# EAGLE design router1.3 (EAGLE 9.1.1)
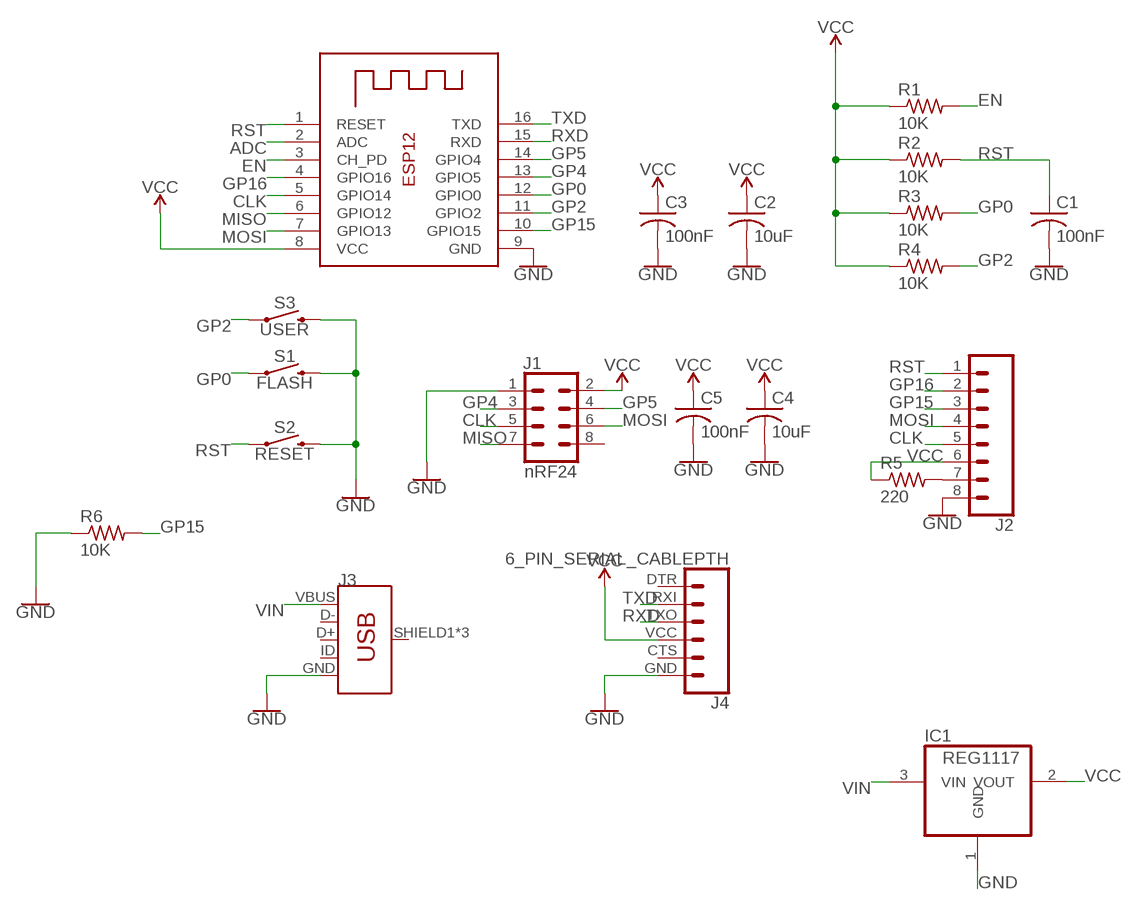
[diagram p0: schematic, sheet 1]

## Parts
C1  100nF  C-USC1206  [C1206]
C2  10uF  C-USC1206  [C1206]
C3  100nF  C-USC1206  [C1206]
C4  10uF  C-USC1206  [C1206]
C5  100nF  C-USC1206  [C1206]
IC1  REG1117  [SOT223]
J1  nRF24  CONN_04X2  [2X4]
J2  CONN_08"  [1X08]
J3  USB_MICRO-B_FEMALE-SMT  [USB-B-MICRO-SMD]
J4  6_PIN_SERIAL_CABLEPTH  [FTDI_BASIC]
R1  10K  R-US_M1206  [M1206]
R2  10K  R-US_M1206  [M1206]
R3  10K  R-US_M1206  [M1206]
R4  10K  R-US_M1206  [M1206]
R5  220  R-US_M1206  [M1206]
R6  10K  R-US_M1206  [M1206]
S1  FLASH  MOMENTARY-SWITCH-SPST-PTH-6.0MM  [TACTILE_SWITCH_PTH_6.0MM]
S2  RESET  MOMENTARY-SWITCH-SPST-PTH-6.0MM  [TACTILE_SWITCH_PTH_6.0MM]
S3  USER  MOMENTARY-SWITCH-SPST-PTH-6.0MM  [TACTILE_SWITCH_PTH_6.0MM]
X1  ESP-12  [ESP-12]

## Nets
ADC: X1.2(ADC)
CLK: J1.5 J2.5 X1.5(GPIO14)
EN: R1.2 X1.3(CH_PD)
GND: C1.2 C2.2 C3.2 C4.2 C5.2 IC1.1(GND) J1.1 J2.8 J3.GND J4.GND R6.1 S1.3 S2.3 S3.3 X1.9(GND)
GP0: R3.2 S1.1 X1.12(GPIO0)
GP2: R4.2 S3.1 X1.11(GPIO2)
GP4: J1.3 X1.13(GPIO5)
GP5: J1.4 X1.14(GPIO4)
GP15: J2.3 R6.2 X1.10(GPIO15)
GP16: J2.2 X1.4(GPIO16)
MISO: J1.7 X1.6(GPIO12)
MOSI: J1.6 J2.4 X1.7(GPIO13)
N$14: J2.7 R5.2
RST: C1.1 J2.1 R2.2 S2.1 X1.1(RESET)
RXD: J4.TXO X1.15(RXD)
TXD: J4.RXI X1.16(TXD)
VCC: C2.1 C3.1 C4.1 C5.1 IC1.2(VOUT) J1.2 J2.6 J4.VCC R1.1 R2.1 R3.1 R4.1 R5.1 X1.8(VCC)
VIN: IC1.3(VIN) J3.VBUS
Unconnected: J1.8 J3.D+ J3.D- J3.ID J3.SHIELD1(SHIELD) J3.SHIELD2(SHIELD) J3.SHIELD3(SHIELD) J4.CTS J4.DTR

## Library data of the parts
C1-C5 = adafruit:C-US: CAPACITOR, American symbol
IC1 = burr-brown:REG1117: 800mA and 1A Low Dropout (LDO) Positive Regulator 1.8V, 2.5V, 2.85V, 3.3V, 5V, and Adj; MPN: REG1117; OC_FARNELL: 1097566; OC_NEWARK: 14P6981
J1 = SparkFun-Connectors:CONN_04X2: Multi connection point. Often used as Generic Header-pin footprint for 0.1 inch spaced/style header connections On any of the 0.1 inch spaced packages, you can populate with these: Break Away Headers - Straight <https://www.sparkfun.com/products/116> (PRT-00116) Break Away Male Headers - Right Angle <https://www.sparkfun.com/products/553> (PRT-00553) Female Headers <https://www.sparkfun.com/products/115> (PRT-00115) Break Away Headers - Machine Pin <https://www.sparkfun.com/products/117> (PRT-00117) Break Away Female Headers - Swiss Machine Pin <https://www.sparkfun.com/products/743> (PRT-00743)
J2 = SparkFun-Connectors:CONN_08: Multi connection point. Often used as Generic Header-pin footprint for 0.1 inch spaced/style header connections On any of the 0.1 inch spaced packages, you can populate with these: Break Away Headers - Straight <https://www.sparkfun.com/products/116> (PRT-00116) Break Away Male Headers - Right Angle <https://www.sparkfun.com/products/553> (PRT-00553) Female Headers <https://www.sparkfun.com/products/115> (PRT-00115) Break Away Headers - Machine Pin <https://www.sparkfun.com/products/117> (PRT-00117) Break Away Female Headers - Swiss Machine Pin <https://www.sparkfun.com/products/743> (PRT-00743) Arduino Stackable Header - 8 Pin <https://www.sparkfun.com/products/9279> (PRT-09279) For SCREWTERMINALS and SPRING TERMINALS visit here: Screw Terimnals on SparkFun.com <https://www.sparkfun.com/search/results?term=Screw+Terminals> (5mm/3.5mm/2.54mm spacing) This device is also useful as a general connection point to wire up your design to another part of your project. Our various solder wires solder well into these plated through hole pads. Hook-Up Wire - Assortment (Stranded, 22 AWG) <https://www.sparkfun.com/products/11375> (PRT-11375) Hook-Up Wire - Assortment (Solid Core, 22 AWG) <https://www.sparkfun.com/products/11367> (PRT-11367) View the entire wire category on our website here <https://www.sparkfun.com/categories/141> Special notes: Molex polarized connector foot print use with SKU : PRT-08231 with associated crimp pins and housings. 1MM SMD Version SKU: PRT-10208 NOTES ON THE VARIANTS LOCK and LOCK_LONGPADS... This footprint was designed to help hold the alignment of a through-hole component (i.e. 6-pin header) while soldering it into place. You may notice that each hole has been shifted either up or down by 0.005 of an inch from it's more standard position (which is a perfectly straight line). This slight alteration caused the pins (the squares in the middle) to touch the edges of the holes. Because they are alternating, it causes a "brace" to hold the component in place. 0.005 has proven to be the perfect amount of "off-center" position when using our standard breakaway headers. Although looks a little odd when you look at the bare footprint, once you have a header in there, the alteration is very hard to notice. Also,if you push a header all the way into place, it is covered up entirely on the bottom side.; PROD_ID: CONN-08438
J3 = SparkFun-Connectors:USB_MICRO-B: USB Type Micro-B Connector Male/female and PTH/SMT variants SparkFun Products: SparkFun microB USB Breakout <https://www.sparkfun.com/products/12035> SparkFun USB microB Plug Breakout <https://www.sparkfun.com/products/10031> SparkFun ESP8266 Thing <https://www.sparkfun.com/products/13231>; PROD_ID: CONN-11752
J4 = SparkFun-Connectors:6_PIN_SERIAL_CABLE: 6-pin header connection for use with the "FTDI BASIC" pinout - CABLE SIDE. Also known as "Arduino Serial Program Header". This is used on a design to provide a 6-pin connection point for serial communication usually from a USB cable (D+/D-) to these headers (RX/TX). It also has the remaining pins necessary for programming in the Arduino evironment (DTR, GND, and sometimes VCC). Note, this device has "CABLE" in the name. It is intended to be used on a design that usually lives on the end of your USB cable and prvides the converter chip (FTDI232 or FTDI231x) to commnicate serial RX/TX. The "sister" device, named "TARGET" is inteneded to be used on a design that contains a target micro-controller that you wish to program. You can populate with some of these: Female Headers <https://www.sparkfun.com/products/115> (PRT-00115) For reference (or to suit your programming needs) check out these designs: SparkFun FTDI Basic Breakout - 5V <https://www.sparkfun.com/products/9716> (DEV-09716) SparkFun FTDI Basic Breakout - 3.3V <https://www.sparkfun.com/products/9873> (DEV-09873) SparkFun FTDI SmartBasic <https://www.sparkfun.com/products/12935> (DEV-12935) SparkFun Beefy 3 - FTDI Basic Breakout <https://www.sparkfun.com/products/13746> (DEV-13746)
R1-R6 = resistor:R-US_: RESISTOR, American symbol
S1-S3 = SparkFun-Switches:MOMENTARY-SWITCH-SPST: Momentary Switch (Pushbutton) - SPST Normally-open (NO) SPST momentary switches (buttons, pushbuttons). Variants PTH-12MM - 12mm square, through-hole Momentary Pushbutton Switch - 12mm Square <https://www.sparkfun.com/products/9190> (COM-09190) PTH-6.0MM, PTH-6.0MM-KIT - 6.0mm square, through-hole Mini Pushbutton Switch <https://www.sparkfun.com/products/97> (COM-00097) KIT package intended for soldering kit's - only one side of pads' copper is exposed. PTH-RIGHT-ANGLE-KIT - Right-angle, through-hole Right Angle Tactile Button <https://www.sparkfun.com/products/10791> - Used on SparkFun BigTime Watch Kit <https://www.sparkfun.com/products/11734> SMD-12MM - 12mm square, surface-mount Tactile Button - SMD (12mm) <https://www.sparkfun.com/products/12993> (COM-12993) Used on SparkFun PicoBoard <https://www.sparkfun.com/products/11888> SMD-4.5MM - 4.5mm Square Trackball Switch Used on SparkFun Blackberry Trackballer Breakout <https://www.sparkfun.com/products/13169> SMD-4.6MMX2.8MM - 4.60mm x 2.80mm, surface mount Used on SparkFun SAMD21 Mini Breakout <https://www.sparkfun.com/products/13664> SMD-5.2MM, SMD-5.2-REDUNDANT - 5.2mm square, surface-mount Mini Pushbutton Switch - SMD <https://www.sparkfun.com/products/8720> (COM-08720) Used on Arduino Pro Mini <https://www.sparkfun.com/products/11114> REDUNDANT package connects both switch circuits together SMD-6.0X3.5MM - 6.0 x 3.5mm, surface mount Momentary Reset Switch SMD <https://www.sparkfun.com/products/8229> (COM-08229) SMD-6.2MM-TALL - 6.2mm square, surface mount Tactile Button - SMD (6mm) <https://www.sparkfun.com/products/12992> Used on SparkFun Digital Sandbox <https://www.sparkfun.com/products/12651> SMD-RIGHT-ANGLE - Right-angle, surface mount Used on SparkFun Block for Intel® Edison - Arduino <https://www.sparkfun.com/products/13036>; PROD_ID: SWCH-08441; SF_SKU: COM-00097
X1 = adafruit:ESP-12

## Board
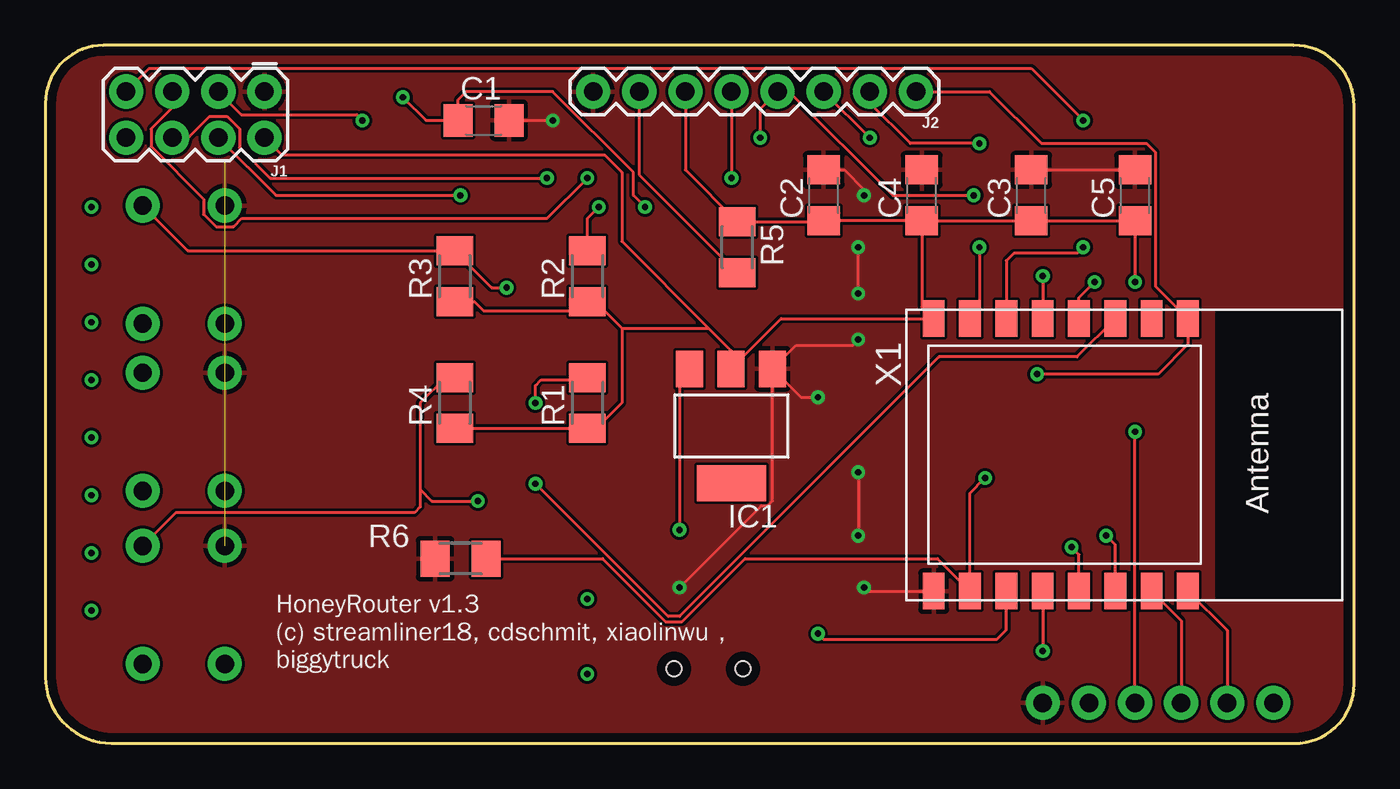
[diagram p1: board, top side]
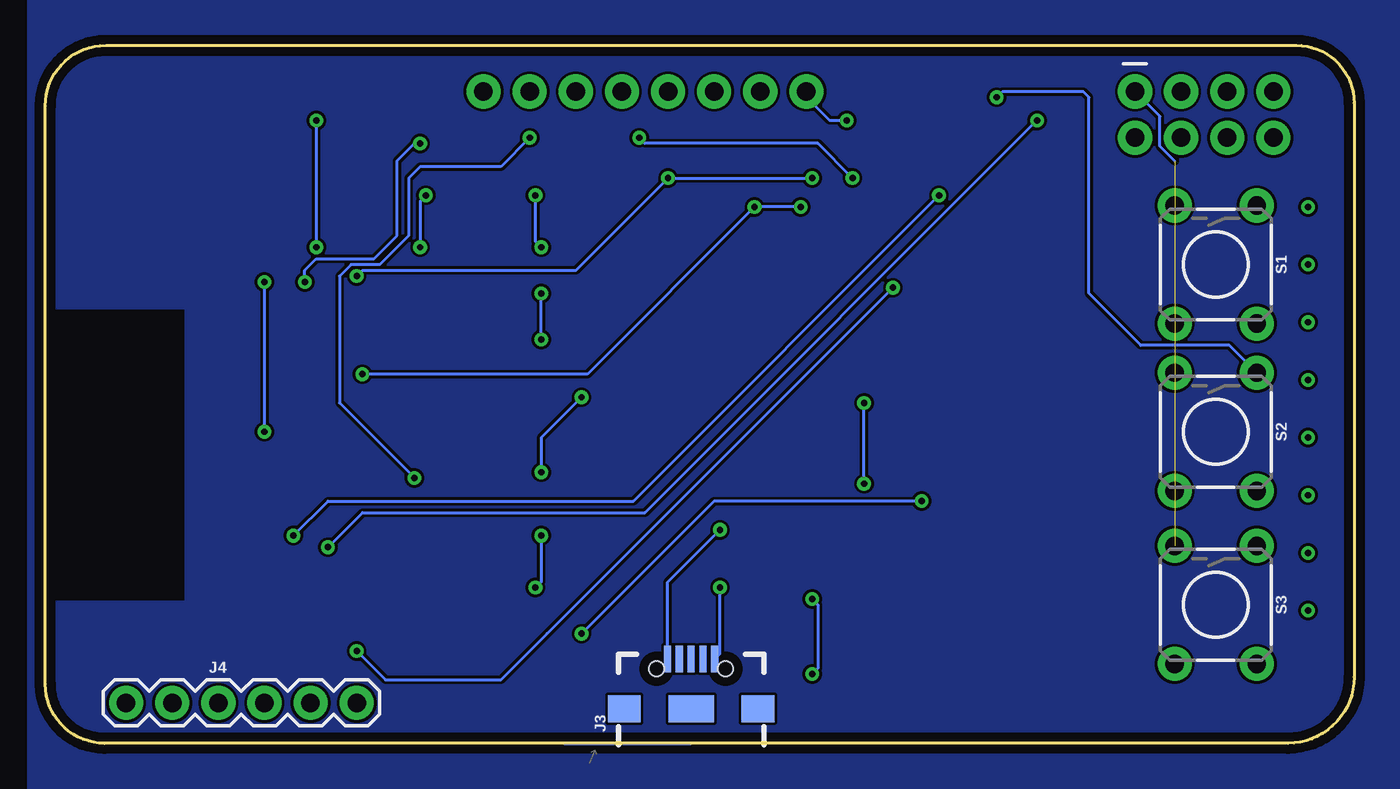
[diagram p2: board, bottom side, seen from below]

Size 72.07 x 38.42 mm. Coordinates in mm from the lower left corner, seen from the top.
Outline: 68.75,38.42 3.17,38.42 arc90 0,35.24 0,3.64 arc90 3.64,0 68.82,0 arc90 72.07,3.25 72.07,35.1 arc90 68.75,38.42
Copper layers (1*16): Top 0.035mm / dielectric 1.5mm / Bottom 0.035mm
Design rules "default *": minimum track width 6mil, minimum drill 0.35mm, track to track 6mil, track to pad 6mil, pad to pad 6mil, via to via 6mil, smd to smd 6mil, copper to edge 20mil, drill to drill 6mil, minimum pad ring 10mil, minimum via ring 8mil, stop-mask expansion 4mil, vias tented up to drill 14mil, thermal gap 10mil

### Footprints (pad centres in the part's own frame; a part is rotated, then mirrored left to right if it is on the bottom)
C1206 = smd 1.6 x 1.8: 1 -1.4,0; 2 1.4,0
SOT223 = smd 1.499 x 2.007: 1 -2.261,-3.15; 2 0.025,-3.15; 3 2.311,-3.15 | smd 3.81 x 2.007: 4 0,3.15
2X4 = drill 1.016 pad 1.88: 1 -3.81,-1.27; 2 -3.81,1.27; 3 -1.27,-1.27; 4 -1.27,1.27; 5 1.27,-1.27; 6 1.27,1.27; 7 3.81,-1.27; 8 3.81,1.27
1X08 = drill 1.016 pad 1.88: 1 0,0; 2 2.54,0; 3 5.08,0; 4 7.62,0; 5 10.16,0; 6 12.7,0; 7 15.24,0; 8 17.78,0
USB-B-MICRO-SMD = smd 1.45 x 0.4: D+ 2.725,0; D- 2.725,0.65; GND 2.725,-1.3; ID 2.725,-0.65; VBUS 2.725,1.3 | smd 1.5 x 1.8: SHIELD1 0,3.685; SHIELD2 0,-3.685 | smd 1.5 x 2.5: SHIELD3 0,0 | hole 0.85: 2.2,1.9; 2.2,-1.9
FTDI_BASIC = drill 1.016 pad 1.88: CTS 10.16,0; DTR 0,0; GND 12.7,0; RXI 2.54,0; TXO 5.08,0; VCC 7.62,0
M1206 = smd 1.6 x 2: 1 -1.4,0; 2 1.4,0
TACTILE_SWITCH_PTH_6.0MM = drill 1.016 pad 1.88: 1 -3.251,2.261; 2 3.251,2.261; 3 -3.251,-2.261; 4 3.251,-2.261
ESP-12 = smd 2 x 1.2: 1 -7.5,4.5; 2 -7.5,2.5; 3 -7.5,0.5; 4 -7.5,-1.5; 5 -7.5,-3.5; 6 -7.5,-5.5; 7 -7.5,-7.5; 8 -7.5,-9.5; 9 7.5,-9.5; 10 7.5,-7.5; 11 7.5,-5.5; 12 7.5,-3.5; 13 7.5,-1.5; 14 7.5,0.5; 15 7.5,2.5; 16 7.5,4.5

### Placement (x,y rotation side)
C1  24.13,34.29 0 top
C2  42.86,30.16 90 top
C3  54.29,30.16 90 top
C4  48.26,30.16 90 top
C5  60.01,30.16 90 top
IC1  37.78,17.46 180 top
J1  8.25,34.61 180 top
J2  47.94,35.88 180 top
J3  36.51,1.91 90 bottom
J4  67.63,2.22 0 bottom
R1  29.84,18.73 90 top
R2  29.84,25.72 90 top
R3  22.54,25.72 90 top
R4  22.54,18.73 90 top
R5  38.1,27.3 270 top
R6  22.86,10.16 0 top
S1  7.62,26.35 270 bottom
S2  7.62,17.15 270 bottom
S3  7.62,7.62 270 bottom
X1  58.42,15.88 270 top

### Tracks (layer width: path | path; a pad name or v marks a point on that pad's centre or on a via)
CLK  (via drill 0.35)
  Top 0.152: v54.93,25.72 v54.92,25.71 X1.5 | J2.5 v37.78,31.12 | J1.5 6.98,34.99 5.82,33.82 5.82,32.85 8.71,29.96 8.71,29.12 9.4,28.44 10.36,28.44 10.82,28.89 27.62,28.89 v29.84,31.12
  Bottom 0.152: v54.93,25.72 54.61,26.03 42.86,26.03 v37.78,31.12 v29.84,31.12
EN  (via drill 0.35)
  Top 0.152: X1.3 56.82,21.27 49.21,21.27 34.92,6.99 34.29,6.99 v26.99,14.29 | v26.99,18.73 26.99,19.68 27.3,20 29.71,20 R1.2
  Bottom 0.152: v26.99,14.29 v26.99,18.73
GND  (via drill 0.35)  (3 unrouted)
  Top 0.152: v34.92,8.57 39.43,13.08 39.78,13.08 40.04,13.34 IC1.1 | C3.2 C5.2 | C1.2 v27.94,34.29 | IC1.1 41.61,19.05 v42.55,19.05 | v44.77,14.92 v44.77,11.43 | v45.09,8.57 45.28,8.37 X1.9 | IC1.1 41.34,21.91 44.45,21.91 v44.77,22.22 | v44.77,24.77 v44.77,27.3 | C2.2 44,31.56 45.09,30.48 v45.09,30.16
  Bottom 0.152: J3.GND 34.92,4.92 v34.92,8.57 | J1.1 10.69,34.51 10.69,32.85 9.88,32.04 | J2.8 30.16,35.56 28.89,34.29 v27.94,34.29 | v42.55,19.05 44.77,16.83 v44.77,14.92 | v44.77,11.43 44.77,8.89 v45.09,8.57 | v44.77,22.22 v44.77,24.77 | v45.09,30.16 45.09,27.62 v44.77,27.3
  pour Top: -0.64,40.96 -0.64,-16.19 72.39,-16.19 72.39,40.96
GP0  (via drill 0.35)
  Top 0.152: v25.4,25.08 24.58,25.08 R3.2 7.85,27.12 S1.1 | v54.93,5.08 X1.12
  Bottom 0.152: v25.4,25.08 44.45,6.03 46.99,3.49 53.34,3.49 v54.93,5.08
GP2  (via drill 0.35)
  Top 0.152: R4.2 22.04,20.13 20.64,18.73 20.64,13.97 | 20.64,13.97 21.27,13.33 v23.81,13.33 | v42.55,6.03 42.86,5.71 52.39,5.71 52.92,6.25 X1.11 | 20.64,13.97 20.64,13.02 20.32,12.7 7.19,12.7 S3.1
  Bottom 0.152: v23.81,13.33 35.24,13.33 v42.55,6.03
GP4  (via drill 0.35)
  Top 0.152: X1.13 56.92,10.39 v56.52,10.8 | J1.3 10.79,34.61 17.14,34.61 v17.46,34.29
  Bottom 0.152: v17.46,34.29 39.05,12.7 54.61,12.7 v56.52,10.8
GP5  (via drill 0.35)
  Top 0.152: X1.14 58.92,10.93 v58.42,11.43 | J1.4 12.7,30.16 v22.86,30.16
  Bottom 0.152: v58.42,11.43 56.52,13.33 39.69,13.33 v22.86,30.16
GP15  (via drill 0.35)
  Top 0.152: J2.3 v45.4,33.34 | v51.75,14.61 50.92,13.77 X1.10 49.13,10.16 38.53,10.16 35.05,6.68 34.16,6.68 30.68,10.16 R6.2
  Bottom 0.152: v45.4,33.34 46.99,31.75 51.44,31.75 52.07,31.12 52.07,27.94 53.66,26.35 55.24,26.35 55.88,25.72 55.88,18.73 v51.75,14.61
GP16  (via drill 0.35)
  Top 0.152: X1.4 56.92,24.53 v57.78,25.4 | v51.44,33.02 47.62,33.02 45.4,35.24 J2.2
  Bottom 0.152: v57.78,25.4 57.78,26.03 57.15,26.67 53.98,26.67 52.7,27.94 52.7,32.07 51.75,33.02 v51.44,33.02
MISO  (via drill 0.35)
  Top 0.152: J1.7 5.71,37.15 54.29,37.15 v57.15,34.29 | v57.15,27.3 56.83,26.99 53.34,26.99 52.92,26.57 X1.6
  Bottom 0.152: v57.15,34.29 v57.15,27.3
MOSI  (via drill 0.35)
  Top 0.152: v51.44,27.3 51.44,23.89 X1.7 | v51.12,30.16 46.67,30.16 40.96,35.88 J2.4 39.37,34.92 v39.37,33.34 | J1.6 7.87,33.34 9.04,34.51 10.01,34.51 10.69,33.82 10.69,32.8 12.38,31.12 v27.62,31.12
  Bottom 0.152: v51.12,30.16 51.44,29.84 v51.44,27.3 | v39.37,33.34 39.05,33.02 29.53,33.02 v27.62,31.12
N$1  (via drill 0.35)
  Bottom 0.152: v29.84,7.94 29.53,7.62 29.53,4.13 v29.84,3.81
N$2
  pour Bottom: -8.26,43.5 73.03,43.5 73.03,-16.19 -8.26,-16.19
N$3  (via drill 0.35)
  other vias: 2.54,29.53
N$4  (via drill 0.35)
  other vias: 2.54,26.35
N$5  (via drill 0.35)
  other vias: 2.54,23.18
N$6  (via drill 0.35)
  other vias: 2.54,20
N$7  (via drill 0.35)
  other vias: 2.54,16.83
N$8  (via drill 0.35)
  other vias: 2.54,13.65
N$9  (via drill 0.35)
  other vias: 2.54,10.48
N$10  (via drill 0.35)
  other vias: 2.54,7.3
N$14
  Top 0.152: J2.7 32.7,31.3 R5.2
RST  (via drill 0.35)
  Top 0.152: J2.1 52,35.88 54.86,33.02 60.64,33.02 61.14,32.53 61.14,25.16 X1.1 62.92,21.96 61.28,20.32 v54.61,20.32 | v30.48,29.53 29.84,28.89 R2.2 | v33.02,29.53 32.38,30.16 32.38,31.43 27.94,35.88 23.18,35.88 22.73,35.43 C1.1 20.95,34.29 v19.68,35.56
  Bottom 0.152: v30.48,29.53 v33.02,29.53 42.23,20.32 v54.61,20.32 | S2.1 6.87,21.91 11.75,21.91 14.6,24.77 14.6,35.56 14.92,35.88 19.37,35.88 v19.68,35.56
RXD
  Top 0.152: X1.15 62.55,6.75 J4.TXO
TXD
  Top 0.152: X1.16 65.09,6.21 J4.RXI
VCC  (via drill 0.35)
  Top 0.152: 48.89,23.37 40.52,23.37 IC1.2 37.76,21.62 36.51,22.86 | 48.89,23.37 X1.8 | C4.1 C2.1 42.8,28.71 R5.1 35.24,31.56 J2.6 | 31.75,22.86 30.29,24.32 R2.1 29.34,23.81 24.13,23.81 23.62,24.32 R3.1 | 31.75,22.86 31.75,18.73 30.16,17.14 29.98,17.33 R1.1 R4.1 | C4.1 48.26,24.01 48.89,23.37 | 31.75,22.86 36.51,22.86 | J1.2 13.02,32.39 30.8,32.39 31.75,31.43 31.75,27.62 36.51,22.86 | J4.VCC v60.01,17.14 | v60.01,25.4 C5.1 C3.1 C4.1
  Bottom 0.152: v60.01,17.14 v60.01,25.4
VIN  (via drill 0.35)
  Top 0.152: IC1.3 34.92,20.07 v34.92,11.75
  Bottom 0.152: J3.VBUS 37.81,8.86 v34.92,11.75

### Text on the board
tNames: HoneyRouter v1.3 / (c) streamliner18, cdschmit, xiaolinwu， / biggytruck